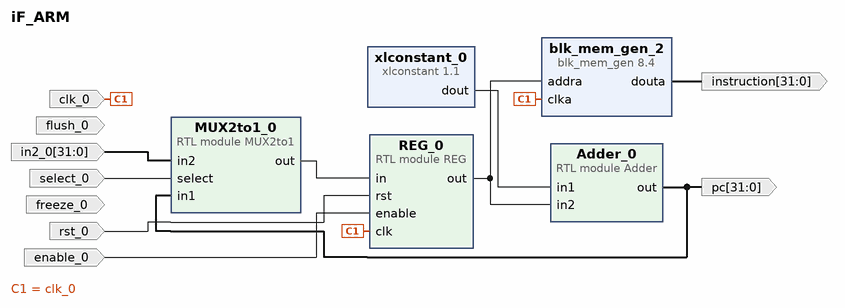
[diagram p0: block diagram of the top level]
# Vivado block design iF_ARM, xc7z010clg400-1, Vivado 2018.3
create_bd_design iF_ARM

create_bd_port -dir I -type clk clk_0
create_bd_port -dir I -type rst rst_0
create_bd_port -dir I -from 31 -to 0 in2_0
create_bd_port -dir I select_0
create_bd_port -dir I enable_0
create_bd_port -dir I freeze_0
create_bd_port -dir I flush_0
create_bd_port -dir O -from 31 -to 0 instruction
create_bd_port -dir O -from 31 -to 0 pc

create_bd_cell -type ip -vlnv xilinx.com:ip:xlconstant:1.1 xlconstant_0
set_property -dict {CONFIG.CONST_WIDTH 32} [get_bd_cells xlconstant_0]
create_bd_cell -type ip -vlnv xilinx.com:ip:blk_mem_gen:8.4 blk_mem_gen_2
set_property -dict [list \
  CONFIG.Coe_File c:/Users/amiri/OneDrive/Desktop/output.coe \
  CONFIG.Enable_32bit_Address false \
  CONFIG.Enable_A Always_Enabled \
  CONFIG.Load_Init_File true \
  CONFIG.Memory_Type Single_Port_ROM \
  CONFIG.Port_A_Write_Rate 0 \
  CONFIG.Register_PortA_Output_of_Memory_Primitives true \
  CONFIG.Use_RSTA_Pin false \
  CONFIG.use_bram_block Stand_Alone \
] [get_bd_cells blk_mem_gen_2]
create_bd_cell -type module -reference MUX2to1 MUX2to1_0
create_bd_cell -type module -reference REG REG_0
create_bd_cell -type module -reference Adder Adder_0

# ---- connections ----

connect_bd_net [get_bd_pins REG_0/out] [get_bd_pins blk_mem_gen_2/addra] [get_bd_pins Adder_0/in2]
connect_bd_net [get_bd_pins MUX2to1_0/out] [get_bd_pins REG_0/in]
connect_bd_net -net clk_0_1 [get_bd_ports clk_0] [get_bd_pins blk_mem_gen_2/clka] [get_bd_pins REG_0/clk]
connect_bd_net -net rst_0_1 [get_bd_ports rst_0] [get_bd_pins REG_0/rst]
connect_bd_net -net in2_0_1 [get_bd_ports in2_0] [get_bd_pins MUX2to1_0/in2]
connect_bd_net -net select_0_1 [get_bd_ports select_0] [get_bd_pins MUX2to1_0/select]
connect_bd_net -net enable_0_1 [get_bd_ports enable_0] [get_bd_pins REG_0/enable]
connect_bd_net [get_bd_pins xlconstant_0/dout] [get_bd_pins Adder_0/in1]
connect_bd_net [get_bd_pins blk_mem_gen_2/douta] [get_bd_ports instruction]
connect_bd_net [get_bd_pins Adder_0/out] [get_bd_ports pc] [get_bd_pins MUX2to1_0/in1]

validate_bd_design
save_bd_design
